# Altium project RGBlinker.PrjPcb
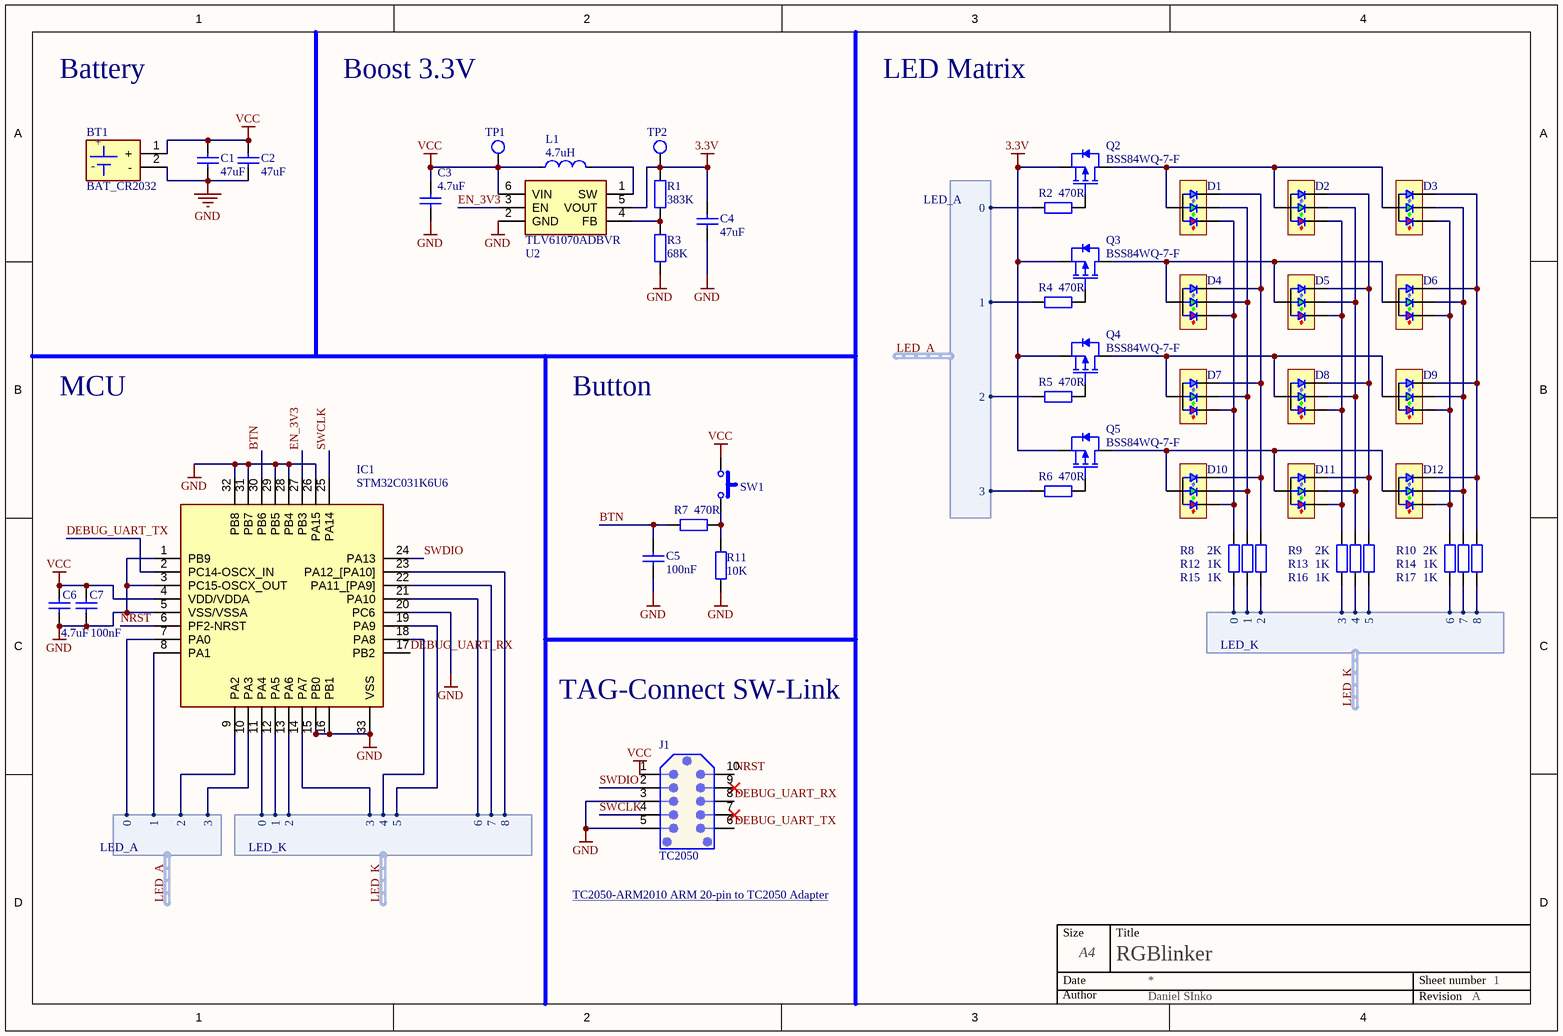
[diagram p0: Main.SchDoc]
1 sheet, 48 parts. Net scope: global (net labels, ports and power ports of the same name join across sheets).
Board file: RGBlink.PcbDoc

## Sheet Main.SchDoc: RGBlinker
size A4; Author: Daniel SInko; Revision: A; SheetNumber: 1; SheetTotal: 1

### Parts
BT1  BAT_CR2032  [BH25F1]
C1  47uF  [CAP0805]
C2  47uF  [CAP0805]
C3  4.7uF  [CAP0603]
C4  47uF  [CAP0805]
C5  100nF  [CAP0603]
C6  4.7uF  [CAP0603]
C7  100nF  [CAP0603]
D1  UHD111A-FKA-C3K23E1L3VG5ZB3Z3  [UHD111A-FKA-C3K23E1L3VG5ZB3Z3]  (value not drawn)
D2  UHD111A-FKA-C3K23E1L3VG5ZB3Z3  [UHD111A-FKA-C3K23E1L3VG5ZB3Z3]  (value not drawn)
D3  UHD111A-FKA-C3K23E1L3VG5ZB3Z3  [UHD111A-FKA-C3K23E1L3VG5ZB3Z3]  (value not drawn)
D4  UHD111A-FKA-C3K23E1L3VG5ZB3Z3  [UHD111A-FKA-C3K23E1L3VG5ZB3Z3]  (value not drawn)
D5  UHD111A-FKA-C3K23E1L3VG5ZB3Z3  [UHD111A-FKA-C3K23E1L3VG5ZB3Z3]  (value not drawn)
D6  UHD111A-FKA-C3K23E1L3VG5ZB3Z3  [UHD111A-FKA-C3K23E1L3VG5ZB3Z3]  (value not drawn)
D7  UHD111A-FKA-C3K23E1L3VG5ZB3Z3  [UHD111A-FKA-C3K23E1L3VG5ZB3Z3]  (value not drawn)
D8  UHD111A-FKA-C3K23E1L3VG5ZB3Z3  [UHD111A-FKA-C3K23E1L3VG5ZB3Z3]  (value not drawn)
D9  UHD111A-FKA-C3K23E1L3VG5ZB3Z3  [UHD111A-FKA-C3K23E1L3VG5ZB3Z3]  (value not drawn)
D10  UHD111A-FKA-C3K23E1L3VG5ZB3Z3  [UHD111A-FKA-C3K23E1L3VG5ZB3Z3]  (value not drawn)
D11  UHD111A-FKA-C3K23E1L3VG5ZB3Z3  [UHD111A-FKA-C3K23E1L3VG5ZB3Z3]  (value not drawn)
D12  UHD111A-FKA-C3K23E1L3VG5ZB3Z3  [UHD111A-FKA-C3K23E1L3VG5ZB3Z3]  (value not drawn)
IC1  STM32C031K6U6  [UFQFPN32-5x5]
J1  TC2050  [TC2050-NL]
L1  value 4.7uH  [IND0603]  (hidden comment: Inductor)
Q2  BSS84WQ-7-F  [SOT-323-3]
Q3  BSS84WQ-7-F  [SOT-323-3]
Q4  BSS84WQ-7-F  [SOT-323-3]
Q5  BSS84WQ-7-F  [SOT-323-3]
R1  383K  [RES0603]
R2  470R  [RES0603]
R3  68K  [RES0603]
R4  470R  [RES0603]
R5  470R  [RES0603]
R6  470R  [RES0603]
R7  470R  [RES0603]
R8  2K  [RES0603]
R9  2K  [RES0603]
R10  2K  [RES0603]
R11  10K  [RES0603]
R12  1K  [RES0603]
R13  1K  [RES0603]
R14  1K  [RES0603]
R15  1K  [RES0603]
R16  1K  [RES0603]
R17  1K  [RES0603]
SW1  TS18-5-25-SL-260-SMT-TR  [BUTTON_LP_5x5]  (value not drawn)
TP1  Test Point  [TP_PAD]  (value not drawn)
TP2  Test Point  [TP_PAD]  (value not drawn)
U2  TLV61070ADBVR  [SOT23-6]

### Harnesses
LED_K: 6, 7, 8, 0, 1, 2, 3, 4, 5
LED_A: 0, 1, 2, 3

### Nets
3.3V: C4.2 Q2.2(S) Q3.2(S) Q4.2(S) Q5.2(S) R1.2 TP2.1 U2.5(VOUT)
GND: BT1.2(-) C1.1 C2.1 C3.1 C4.1 C5.2 C6.1 C7.1 IC1.1(PB9) IC1.3(PC15-OSCX_OUT) IC1.5(VSS/VSSA) IC1.15(PB0) IC1.16(PB1) IC1.20(PC6) IC1.26(PA15) IC1.28(PB4) IC1.29(PB5) IC1.31(PB7) IC1.32(PB8) IC1.33(VSS) J1.3 J1.5 R3.1 R11.1 U2.2(GND)
VCC: BT1.1(+) C1.2 C2.2 C3.2 C6.2 C7.2 IC1.4(VDD/VDDA) J1.1 L1.1 SW1.1 TP1.1 U2.6(VIN)
BTN: C5.1 IC1.30(PB6) R7.2
DEBUG_UART_RX: IC1.17(PB2) J1.8
DEBUG_UART_TX: IC1.2(PC14-OSCX_IN) J1.6
EN_3V3: IC1.27(PB3) U2.3(EN)
LED_A.0: IC1.7(PA0) R2.2 ; harness LED_A.0
LED_A.1: IC1.8(PA1) R4.2 ; harness LED_A.1
LED_A.2: IC1.9(PA2) R5.2 ; harness LED_A.2
LED_A.3: IC1.10(PA3) R6.2 ; harness LED_A.3
LED_K.0: IC1.11(PA4) R8.1 ; harness LED_K.0
LED_K.1: IC1.12(PA5) R12.1 ; harness LED_K.1
LED_K.2: IC1.13(PA6) R15.1 ; harness LED_K.2
LED_K.3: IC1.14(PA7) R9.1 ; harness LED_K.3
LED_K.4: IC1.18(PA8) R13.1 ; harness LED_K.4
LED_K.5: IC1.19(PA9) R16.1 ; harness LED_K.5
LED_K.6: IC1.21(PA10) R10.1 ; harness LED_K.6
LED_K.7: IC1.22(PA11_[PA9]) R14.1 ; harness LED_K.7
LED_K.8: IC1.23(PA12_[PA10]) R17.1 ; harness LED_K.8
NRST: IC1.6(PF2-NRST) J1.10
SWCLK: IC1.25(PA14) J1.4
SWDIO: IC1.24(PA13) J1.2
NetD1_1: D1.1 D4.1 D7.1 D10.1 R15.2
NetD1_2: D1.2 D4.2 D7.2 D10.2 R12.2
NetD1_3: D1.3 D4.3 D7.3 D10.3 R8.2
NetD1_4: D1.4 D2.4 D3.4 Q2.3(D)
NetD2_1: D2.1 D5.1 D8.1 D11.1 R16.2
NetD2_2: D2.2 D5.2 D8.2 D11.2 R13.2
NetD2_3: D2.3 D5.3 D8.3 D11.3 R9.2
NetD3_1: D3.1 D6.1 D9.1 D12.1 R17.2
NetD3_2: D3.2 D6.2 D9.2 D12.2 R14.2
NetD3_3: D3.3 D6.3 D9.3 D12.3 R10.2
NetD4_4: D4.4 D5.4 D6.4 Q3.3(D)
NetD7_4: D7.4 D8.4 D9.4 Q4.3(D)
NetD10_4: D10.4 D11.4 D12.4 Q5.3(D)
NetL1_2: L1.2 U2.1(SW)
NetQ2_1: Q2.1(G) R2.1
NetQ3_1: Q3.1(G) R4.1
NetQ4_1: Q4.1(G) R5.1
NetQ5_1: Q5.1(G) R6.1
NetR1_1: R1.1 R3.2 U2.4(FB)
NetR7_1: R7.1 R11.2 SW1.2

Not connected (* = marked no-connect by the designer): J1 7* 9*

### Notes on the sheet
- Battery
- Boost 3.3V
- LED Matrix
- MCU
- Button
- TAG-Connect SW-Link
- TC2050-ARM2010 ARM 20-pin to TC2050 Adapter <https://www.tag-connect.com/wp-content/uploads/bsk-pdf-manager/2021/02/TC2050-ARM2010-2021.pdf>
- Size
- Date
- A4
- Title
- Sheet number
- Author
- Revision

### Library data of the parts
BT1 = BAT_CR2032: CR2032 isolated battery holder / BH-25F-1; Manufacturer_Name: Adam Tech; Datasheet Link: https://app.adam-tech.com/products/download/data_sheet/196966/bh-25f-1-data-sheet.pdf; Height: 9.5mm; Manufacturer_Part_Number: BH-25F-1; Mouser Price/Stock: https://www.mouser.co.uk/ProductDetail/Adam-Tech/BH-25F-1?qs=HoCaDK9Nz5dcCnxRauSciw%3D%3D; Arrow Part Number: BH-25F-1; Arrow Price/Stock: https://www.arrow.com/en/products/bh-25f-1/adam-tech?region=europe; Supplier Part Number: 737-BH-25F-1
C1 C2 C4 = 47uF: Ceramic Capacitor, Multilayer, Ceramic, 6.3V, 20% +Tol, 20% -Tol, X5R, 15% TC, 47uF, Surface Mount, 0805; Manufacturer: Samsung; Manufacturer Part Number: CL21A476MQYNNNE; Multilayer: Yes; Voltage: *; Supplier: Mouser; Supplier Part Number: 187-CL21A476MQYNNNE; RoHS: Yes; Category: Ceramic Capacitors; Stock: 210015; Pricing: 1=0.18, 10=0.073, 50=0.073, 100=0.063, 1000=0.052, 10000=0.041 (USD); Mounting Technology: Surface Mount; Pins: 2; Dielectric Material: Ceramic; Package Shape: Rectangular; Case/Package: 0805; Terminal Finish: Nickel; Min Operating Temperature: -55°C; Max Operating Temperature: 85°C; JESD-609 Code: e3; Capacitor Type: Ceramic; Tolerance  (fill in as +-): 20%; Package Style: SMTMeter; Packaging: Tape and Reel; Tolerance (fill in as +-): 20%; Rated DC Voltage (URdc): 6.3V; Temperature Characteristics Code: X5R; Termination: Wraparound; Length: 2mm; Width: 1.25mm; Height: 1.25mm; Reach SVHC Compliant: Yes; RoHS Compliant: Yes; ComponentLink1URL: https://datasheet.ciiva.com:443/pdfs/VipMasterIC/IC/SEMS/SEMS-S-A0008384515/SEMS-S-A0008898940-1.pdf?src-supplier=IHS+Markit; ComponentLink1Description: https://datasheet.ciiva.com:443/pdfs/VipMasterIC/IC/SEMS/SEMS-S-A0008384515/SEMS-S-A0008898940-1.pdf?src-supplier=IHS+Markit; ComponentLink2URL: https://datasheet.ciiva.com/25791/cl21a476mqynnne-25791153.pdf?src-supplier=Digikey; ComponentLink2Description: https://datasheet.ciiva.com/25791/cl21a476mqynnne-25791153.pdf?src-supplier=Digikey; ComponentLink3URL: https://datasheet.ciiva.com/26838/getdatasheetpartid-359050-26838632.pdf?src-supplier=Verical; ComponentLink3Description: https://datasheet.ciiva.com/26838/getdatasheetpartid-359050-26838632.pdf?src-supplier=Verical; Value: 47uF
C3 C6 = 4.7uF: Capacitor; Voltage: *; Value: 4.7uF; Supplier Part Number: 187-CL10A475KP8NNWC
C5 C7 = 100nF: Ceramic Capacitor, Multilayer, Ceramic, 6.3V, 20% +Tol, 20% -Tol, X5R, 15% TC, 47uF, Surface Mount, 0805; Manufacturer: Samsung; Manufacturer Part Number: CL21A476MQYNNNE; Multilayer: Yes; Voltage: *; Value: 100nF; Supplier: Mouser; Supplier Part Number: 187-CL21A476MQYNNNE; RoHS: Yes; Category: Ceramic Capacitors; Stock: 210015; Pricing: 1=0.18, 10=0.073, 50=0.073, 100=0.063, 1000=0.052, 10000=0.041 (USD); Mounting Technology: Surface Mount; Pins: 2; Dielectric Material: Ceramic; Package Shape: Rectangular; Case/Package: 0805; Terminal Finish: Nickel; Min Operating Temperature: -55°C; Max Operating Temperature: 85°C; JESD-609 Code: e3; Capacitor Type: Ceramic; Tolerance  (fill in as +-): 20%; Package Style: SMTMeter; Packaging: Tape and Reel; Tolerance (fill in as +-): 20%; Rated DC Voltage (URdc): 6.3V; Temperature Characteristics Code: X5R; Termination: Wraparound; Length: 2mm; Width: 1.25mm; Height: 1.25mm; Reach SVHC Compliant: Yes; RoHS Compliant: Yes; ComponentLink1URL: https://datasheet.ciiva.com:443/pdfs/VipMasterIC/IC/SEMS/SEMS-S-A0008384515/SEMS-S-A0008898940-1.pdf?src-supplier=IHS+Markit; ComponentLink1Description: https://datasheet.ciiva.com:443/pdfs/VipMasterIC/IC/SEMS/SEMS-S-A0008384515/SEMS-S-A0008898940-1.pdf?src-supplier=IHS+Markit; ComponentLink2URL: https://datasheet.ciiva.com/25791/cl21a476mqynnne-25791153.pdf?src-supplier=Digikey; ComponentLink2Description: https://datasheet.ciiva.com/25791/cl21a476mqynnne-25791153.pdf?src-supplier=Digikey; ComponentLink3URL: https://datasheet.ciiva.com/26838/getdatasheetpartid-359050-26838632.pdf?src-supplier=Verical; ComponentLink3Description: https://datasheet.ciiva.com/26838/getdatasheetpartid-359050-26838632.pdf?src-supplier=Verical
IC1 = STM32C031K6U6: Integrated Circuit; Manufacturer_Name: STMicroelectronics; Datasheet Link: https://www.st.com/resource/en/datasheet/stm32c031c4.pdf; Height: 0.6mm; Manufacturer_Part_Number: STM32C031K6U6; Mouser Price/Stock: https://www.mouser.co.uk/ProductDetail/STMicroelectronics/STM32C031K6U6?qs=IPgv5n7u5QaHL3ukKksvIA%3D%3D; Arrow Part Number: STM32C031K6U6; Arrow Price/Stock: https://www.arrow.com/en/products/stm32c031k6u6/stmicroelectronics?region=nac; Supplier Part Number: 511-STM32C031K6U6
J1 = TC2050: TC2050 JTAG CONNECTOR DNP
L1 = 4.7uH: General Purpose Inductor, 4.7uH, 20%, 1 Element, Ferrite-Core, SMD, 1608M; Manufacturer: TDK; Manufacturer Part Number: MLZ1608E4R7MT; Manufacturer Series: MLZ; Case/Size Code: 1608-M; DC Resistance (DCR): 500mR; Inductor Application: POWER INDUCTOR; Channels: 1; Max Current Rating: 350mA; Self Resonant Frequency: 80MHz; Shape/Size Description: RECTANGULAR PACKAGE; Shielding: Shielded; Test Frequency: 2MHz; Package Height: 0.8mm; Package Length: 1.6mm; Supplier: Mouser; Supplier Part Number: 810-MLZ1608E4R7MT; RoHS: Yes; Category: Fixed Inductors; Stock: 10382; Pricing: 1=0.1, 10=0.063, 50=0.063, 100=0.053, 1000=0.047, 10000=0.038 (USD); Pins: 2; Terminal Finish: Tin; Core Material: Ferrite; Min Operating Temperature: -55°C; Max Operating Temperature: 125°C; Tolerance: 20%; JESD-609 Code: e3; Inductance-Nom (L): 4.7uH; Inductor Type: GENERAL PURPOSE INDUCTOR; Surface Mount: Yes; Terminal Placement: Dual Ended; Termination: Wraparound; Construction: Magnetic Shielded; Package Style: SMTMeter; Packaging: Tape and Reel; Series: MLZ1608; Package Width: 0.8mm; Reach SVHC Compliant: Yes; RoHS Compliant: Yes; ComponentLink1URL: https://datasheet.ciiva.com:443/pdfs/VipMasterIC/IC/TDKC/TDKCS08829/TDKCS08829-1.pdf?src-supplier=IHS+Markit; ComponentLink1Description: https://datasheet.ciiva.com:443/pdfs/VipMasterIC/IC/TDKC/TDKCS08829/TDKCS08829-1.pdf?src-supplier=IHS+Markit; ComponentLink2URL: https://datasheet.ciiva.com/11802/0900766b8082f86f-11802261.pdf?src-supplier=Rs; ComponentLink2Description: https://datasheet.ciiva.com/11802/0900766b8082f86f-11802261.pdf?src-supplier=Rs
Q2-Q5 = BSS84WQ-7-F: MOSFET (P-Channel); Manufacturer_Name: Diodes Incorporated; Datasheet Link: https://www.diodes.com//assets/Datasheets/BSS84WQ.pdf; Height: 1.1mm; Manufacturer_Part_Number: BSS84WQ-7-F; Mouser Price/Stock: https://www.mouser.co.uk/ProductDetail/Diodes-Incorporated/BSS84WQ-7-F?qs=wtVJq%252Be05r%252B5TZHG3xVH8w%3D%3D; Arrow Part Number: BSS84WQ-7-F; Arrow Price/Stock: https://www.arrow.com/en/products/bss84wq-7-f/diodes-incorporated?region=nac; Supplier Part Number: 621-BSS84WQ-7-F
R1 = 383K: Fixed Resistor, Metal Glaze/thick Film, 0.1W, 383000ohm, 75V, 1% +/-Tol, 100ppm/Cel, Surface Mount, 0603; Manufacturer: Vishay; Manufacturer Part Number: CRCW0603383KFKEA; Temperature Coefficient (ppm/Cel): 100; Rated Temperature: 70°C; Package Height: 0.45mm; Package Length: 1.55mm; Package Width: 0.85mm; Reference Standard: AEC-Q200; Value: 383K; Supplier Part Number: 71-CRCW0603-383K-E3; RoHS: Yes; Category: Chip SMD Resistors; Stock: 18992; Pricing: 1=0.1, 10=0.017, 50=0.017, 100=0.014, 1000=0.008, 10000=0.004 (USD); Mounting Technology: Surface Mount; Pins: 2; Case/Package: 0603; Terminal Finish: Nickel; Package Shape: Rectangular; Min Operating Temperature: -55°C; Max Operating Temperature: 155°C; JESD-609 Code: e3; Resistor Type: FIXED RESISTOR; Construction: Chip; Packaging: Tape and Reel; Technology: METAL GLAZE/THICK FILM; Working Voltage: 75V; Termination: Wraparound; Reach SVHC Compliant: Yes; RoHS Compliant: Yes; ComponentLink1URL: https://datasheet.ciiva.com:443/pdfs/VipMasterIC/IC/VISH/VISH-S-A0007266705/VISH-S-A0007266705-1.pdf?src-supplier=IHS+Markit; ComponentLink1Description: https://datasheet.ciiva.com:443/pdfs/VipMasterIC/IC/VISH/VISH-S-A0007266705/VISH-S-A0007266705-1.pdf?src-supplier=IHS+Markit; ComponentLink2URL: https://datasheet.ciiva.com/16204/dcrcwe3-16204191.pdf?src-supplier=Future+Electronics; ComponentLink2Description: https://datasheet.ciiva.com/16204/dcrcwe3-16204191.pdf?src-supplier=Future+Electronics; ComponentLink3URL: https://datasheet.ciiva.com/5543/dcrcwe3-109170-5543275.pdf?src-supplier=Mouser; ComponentLink3Description: https://datasheet.ciiva.com/5543/dcrcwe3-109170-5543275.pdf?src-supplier=Mouser; ComponentLink4URL: https://datasheet.ciiva.com/7674/1697337-7674088.pdf?src-supplier=Element14; ComponentLink4Description: https://datasheet.ciiva.com/7674/1697337-7674088.pdf?src-supplier=Element14; ComponentLink5URL: https://datasheet.ciiva.com/7674/1697337-7674089.pdf?src-supplier=Element14; ComponentLink5Description: https://datasheet.ciiva.com/7674/1697337-7674089.pdf?src-supplier=Element14; ComponentLink6URL: https://datasheet.ciiva.com/7792/125364-7792239.pdf?src-supplier=Element14; ComponentLink6Description: https://datasheet.ciiva.com/7792/125364-7792239.pdf?src-supplier=Element14; ComponentLink7URL: https://datasheet.ciiva.com/2466/dcrcwe3-2466635.pdf?src-supplier=Digikey; ComponentLink7Description: https://datasheet.ciiva.com/2466/dcrcwe3-2466635.pdf?src-supplier=Digikey; ComponentLink8URL: https://datasheet.ciiva.com/2466/dcrcwe3-2466636.pdf?src-supplier=Digikey; ComponentLink8Description: https://datasheet.ciiva.com/2466/dcrcwe3-2466636.pdf?src-supplier=Digikey; ComponentLink9URL: https://datasheet.ciiva.com/2466/dcrcwe3-2466637.pdf?src-supplier=Digikey; ComponentLink9Description: https://datasheet.ciiva.com/2466/dcrcwe3-2466637.pdf?src-supplier=Digikey
R2 R4-R7 = 470R: Fixed Resistor, Metal Glaze/thick Film, 0.1W, 470ohm, 75V, 1% +/-Tol, 100ppm/Cel, Surface Mount, 0603; Manufacturer: Yageo; Manufacturer Part Number: RC0603FR-07470RL; Additional Feature: LASER TRIMMABLE; Rated Temperature: 70°C; Temperature Coefficient (ppm/Cel): 100; Package Height: 0.45mm; Package Length: 1.6mm; Package Width: 0.8mm; Value: 470R; Supplier Part Number: 603-RC0603FR-07470RL; RoHS: Yes; Category: Chip SMD Resistors; Stock: 609861; Pricing: 1=0.1, 10=0.008, 50=0.008, 100=0.007, 1000=0.006, 10000=0.002 (USD); Mounting Technology: Surface Mount; Pins: 2; Package Shape: Rectangular; Case/Package: 0603; Terminal Finish: Nickel; Min Operating Temperature: -55°C; Max Operating Temperature: 155°C; JESD-609 Code: e3; Resistor Type: FIXED RESISTOR; Construction: Chip; Packaging: Tape and Reel; Technology: METAL GLAZE/THICK FILM; Termination: Wraparound; Working Voltage: 75V; Reach SVHC Compliant: Yes; RoHS Compliant: Yes; ComponentLink1URL: https://datasheet.ciiva.com:443/pdfs/VipMasterIC/IC/YAGO/YAGO-S-A0008145938/YAGO-S-A0008145938-1.pdf?src-supplier=IHS+Markit; ComponentLink1Description: https://datasheet.ciiva.com:443/pdfs/VipMasterIC/IC/YAGO/YAGO-S-A0008145938/YAGO-S-A0008145938-1.pdf?src-supplier=IHS+Markit; ComponentLink2URL: https://datasheet.ciiva.com/11808/0900766b80f96399-11808177.pdf?src-supplier=Rs; ComponentLink2Description: https://datasheet.ciiva.com/11808/0900766b80f96399-11808177.pdf?src-supplier=Rs; ComponentLink3URL: https://datasheet.ciiva.com/7660/1868787-7660793.pdf?src-supplier=Element14; ComponentLink3Description: https://datasheet.ciiva.com/7660/1868787-7660793.pdf?src-supplier=Element14; ComponentLink4URL: https://datasheet.ciiva.com/46440/1868787-46440907.pdf?src-supplier=Element14; ComponentLink4Description: https://datasheet.ciiva.com/46440/1868787-46440907.pdf?src-supplier=Element14; ComponentLink5URL: https://datasheet.ciiva.com/2454/pyu-r-int-thick-7-2454013.pdf?src-supplier=Digikey; ComponentLink5Description: https://datasheet.ciiva.com/2454/pyu-r-int-thick-7-2454013.pdf?src-supplier=Digikey; ComponentLink6URL: https://datasheet.ciiva.com/2454/pyu-r-int-thick-7-2454014.pdf?src-supplier=Digikey; ComponentLink6Description: https://datasheet.ciiva.com/2454/pyu-r-int-thick-7-2454014.pdf?src-supplier=Digikey; ComponentLink7URL: https://datasheet.ciiva.com/2454/pyu-r-int-thick-7-2454012.pdf?src-supplier=Digikey; ComponentLink7Description: https://datasheet.ciiva.com/2454/pyu-r-int-thick-7-2454012.pdf?src-supplier=Digikey; ComponentLink8URL: https://datasheet.ciiva.com/7746/1738695-7746360.pdf?src-supplier=Element14; ComponentLink8Description: https://datasheet.ciiva.com/7746/1738695-7746360.pdf?src-supplier=Element14; ComponentLink9URL: https://datasheet.ciiva.com/7746/1738695-7746359.pdf?src-supplier=Element14; ComponentLink9Description: https://datasheet.ciiva.com/7746/1738695-7746359.pdf?src-supplier=Element14
R3 = 68K: Fixed Resistor, Metal Glaze/thick Film, 0.1W, 68000ohm, 50V, 1% +/-Tol, 100ppm/Cel, Surface Mount, 0603; Manufacturer: TE Connectivity; Manufacturer Part Number: CRG0603F68K; Manufacturer Series: CRG; Additional Feature: LASER TRIMMABLE; Rated Temperature: 70°C; Temperature Coefficient (ppm/Cel): 100; Value: 68K; Supplier Part Number: 279-CRG0603F68K; RoHS: Yes; Category: Chip SMD Resistors; Stock: 24887; Pricing: 1=0.1, 10=0.019, 50=0.019, 100=0.011, 1000=0.006, 10000=0.004 (USD); Mounting Technology: Surface Mount; Pins: 2; Package Shape: Rectangular; Case/Package: 0603; Terminal Finish: Tin; Min Operating Temperature: -55°C; Max Operating Temperature: 125°C; JESD-609 Code: e3; Resistor Type: FIXED RESISTOR; Packaging: Tape and Reel; Technology: METAL GLAZE/THICK FILM; Termination: Wraparound; Working Voltage: 50V; RoHS Compliant: Yes; ComponentLink1URL: https://datasheet.ciiva.com:443/pdfs/VipMasterIC/IC/TYEC/TYECS00469/TYECS00469-1.pdf?src-supplier=IHS+Markit; ComponentLink1Description: https://datasheet.ciiva.com:443/pdfs/VipMasterIC/IC/TYEC/TYECS00469/TYECS00469-1.pdf?src-supplier=IHS+Markit; ComponentLink2URL: https://datasheet.ciiva.com/2529/eng-cd-1622987-ba-2529849.pdf?src-supplier=Digikey; ComponentLink2Description: https://datasheet.ciiva.com/2529/eng-cd-1622987-ba-2529849.pdf?src-supplier=Digikey; ComponentLink3URL: https://datasheet.ciiva.com/11811/0900766b800a696e-11811113.pdf?src-supplier=Rs; ComponentLink3Description: https://datasheet.ciiva.com/11811/0900766b800a696e-11811113.pdf?src-supplier=Rs; ComponentLink4URL: https://datasheet.ciiva.com/30183/eng-ds-1773204-e-30183934.pdf?src-supplier=Onlinecomponents.com; ComponentLink4Description: https://datasheet.ciiva.com/30183/eng-ds-1773204-e-30183934.pdf?src-supplier=Onlinecomponents.com; ComponentLink5URL: https://datasheet.ciiva.com/5562/eng-ds-1773204-g-5562568.pdf?src-supplier=Mouser; ComponentLink5Description: https://datasheet.ciiva.com/5562/eng-ds-1773204-g-5562568.pdf?src-supplier=Mouser; ComponentLink6URL: https://datasheet.ciiva.com/24412/eng-ds-1773204-e-24412331.pdf?src-supplier=Onlinecomponents.com; ComponentLink6Description: https://datasheet.ciiva.com/24412/eng-ds-1773204-e-24412331.pdf?src-supplier=Onlinecomponents.com
R8-R10 = 2K: Fixed Resistor, Metal Glaze/thick Film, 0.1W, 2000ohm, 75V, 1% +/-Tol, 100ppm/Cel, Surface Mount, 0603; Manufacturer: Stackpole Electronics; Manufacturer Part Number: RMCF0603FG2K00; Rated Temperature: 70°C; Temperature Coefficient (ppm/Cel): 100; Package Height: 0.45mm; Package Length: 1.55mm; Package Width: 0.8mm; Reference Standard: AEC-Q200; Supplier Part Number: 708-RMCF0603FG2K00; RoHS: Yes; Category: Chip SMD Resistors; Stock: 24767; Pricing: 1=0.1, 10=0.009, 50=0.009, 100=0.008, 1000=0.004, 10000=0.002 (USD); Mounting Technology: Surface Mount; Pins: 2; Package Shape: Rectangular; Case/Package: 0603; Terminal Finish: Nickel; Min Operating Temperature: -55°C; Max Operating Temperature: 155°C; JESD-609 Code: e3; Resistor Type: FIXED RESISTOR; Construction: Rectangular; Packaging: Tape and Reel; Technology: METAL GLAZE/THICK FILM; Termination: Wraparound; Working Voltage: 75V; Reach SVHC Compliant: Yes; RoHS Compliant: Yes; ComponentLink1URL: https://datasheet.ciiva.com:443/pdfs/VipMasterIC/IC/SEIE/SEIE-S-A0009541969/SEIE-S-A0009541969-1.pdf?src-supplier=IHS+Markit; ComponentLink1Description: https://datasheet.ciiva.com:443/pdfs/VipMasterIC/IC/SEIE/SEIE-S-A0009541969/SEIE-S-A0009541969-1.pdf?src-supplier=IHS+Markit; ComponentLink2URL: https://www.seielect.com/catalog/sei-rmcf_rmcp.pdf?src-supplier=Digikey; ComponentLink2Description: https://www.seielect.com/catalog/sei-rmcf_rmcp.pdf?src-supplier=Digikey; ComponentLink3URL: https://www.seielect.com/catalog/SEI-RMCF_RMCP.pdf?src-supplier=Avnet; ComponentLink3Description: https://www.seielect.com/catalog/SEI-RMCF_RMCP.pdf?src-supplier=Avnet; Value: 2K
R11 = 10K: Fixed Resistor, Metal Glaze/thick Film, 0.1W, 10000ohm, 75V, 1% +/-Tol, 100ppm/Cel, Surface Mount, 0603; Manufacturer: Bourns; Manufacturer Part Number: CR0603-FX-1002ELF; Rated Temperature: 70°C; Temperature Coefficient: 100ppm/°C; Working Voltage: 50V; Package Height: 0.45mm; Package Length: 1.6mm; Package Width: 0.8mm; Supplier Part Number: 652-CR0603FX-1002ELF; RoHS: Yes; Category: Chip SMD Resistors; Stock: 335503; Pricing: 1=0.1, 10=0.009, 50=0.009, 100=0.005, 1000=0.004, 10000=0.002 (USD); Mounting Technology: Surface Mount; Pins: 2; Package Shape: Rectangular; Case/Package: 0603; Terminal Finish: Nickel; Min Operating Temperature: -55°C; Max Operating Temperature: 155°C; Termination: Wraparound; JESD-609 Code: e3; Resistor Type: FIXED RESISTOR; Construction: Chip; Packaging: Tape and Reel; Technology: RUTHENIUM OXIDE; Reach SVHC Compliant: Yes; RoHS Compliant: Yes; ComponentLink1URL: https://datasheet.ciiva.com:443/pdfs/VipMasterIC/IC/BOUR/BOUR-S-A0009069624/BOUR-S-A0009069624-1.pdf?src-supplier=IHS+Markit; ComponentLink1Description: https://datasheet.ciiva.com:443/pdfs/VipMasterIC/IC/BOUR/BOUR-S-A0009069624/BOUR-S-A0009069624-1.pdf?src-supplier=IHS+Markit; ComponentLink2URL: https://datasheet.ciiva.com/11808/0900766b80fcdb72-11808032.pdf?src-supplier=Rs; ComponentLink2Description: https://datasheet.ciiva.com/11808/0900766b80fcdb72-11808032.pdf?src-supplier=Rs; ComponentLink3URL: https://datasheet.ciiva.com/27049/774903-27049975.pdf?src-supplier=Jameco; ComponentLink3Description: https://datasheet.ciiva.com/27049/774903-27049975.pdf?src-supplier=Jameco; ComponentLink4URL: https://datasheet.ciiva.com/22644/1849498-22644171.pdf?src-supplier=Element14; ComponentLink4Description: https://datasheet.ciiva.com/22644/1849498-22644171.pdf?src-supplier=Element14; ComponentLink5URL: https://datasheet.ciiva.com/22693/1902866-22693206.pdf?src-supplier=Element14; ComponentLink5Description: https://datasheet.ciiva.com/22693/1902866-22693206.pdf?src-supplier=Element14; ComponentLink6URL: https://datasheet.ciiva.com/5548/chpreztr-5548911.pdf?src-supplier=Mouser; ComponentLink6Description: https://datasheet.ciiva.com/5548/chpreztr-5548911.pdf?src-supplier=Mouser; ComponentLink7URL: https://datasheet.ciiva.com/16757/70154685-16757483.pdf?src-supplier=Allied+Electronics; ComponentLink7Description: https://datasheet.ciiva.com/16757/70154685-16757483.pdf?src-supplier=Allied+Electronics; ComponentLink8URL: https://datasheet.ciiva.com/3255/chpreztr-3255918.pdf?src-supplier=Avnet; ComponentLink8Description: https://datasheet.ciiva.com/3255/chpreztr-3255918.pdf?src-supplier=Avnet; ComponentLink9URL: https://datasheet.ciiva.com/7001/1902866-7001623.pdf?src-supplier=Newark; ComponentLink9Description: https://datasheet.ciiva.com/7001/1902866-7001623.pdf?src-supplier=Newark; Value: 10K
R12-R17 = 1K: Fixed Resistor, Metal Glaze/thick Film, 0.1W, 1000ohm, 75V, 1% +/-Tol, 100ppm/Cel, Surface Mount, 0603; Manufacturer: Bourns; Manufacturer Part Number: CR0603-FX-1001ELF; Rated Temperature: 70°C; Temperature Coefficient: 100ppm/°C; Working Voltage: 50V; Package Height: 0.45mm; Package Length: 1.6mm; Package Width: 0.8mm; Supplier Part Number: 652-CR0603FX-1001ELF; RoHS: Yes; Category: Chip SMD Resistors; Stock: 320220; Pricing: 1=0.1, 10=0.009, 50=0.009, 100=0.005, 1000=0.004, 10000=0.002 (USD); Mounting Technology: Surface Mount; Pins: 2; Package Shape: Rectangular; Case/Package: 0603; Terminal Finish: Nickel; Min Operating Temperature: -55°C; Max Operating Temperature: 155°C; JESD-609 Code: e3; Termination: Wraparound; Resistor Type: FIXED RESISTOR; Construction: Chip; Packaging: Tape and Reel; Technology: RUTHENIUM OXIDE; Reach SVHC Compliant: Yes; RoHS Compliant: Yes; ComponentLink1URL: https://datasheet.ciiva.com:443/pdfs/VipMasterIC/IC/BOUR/BOUR-S-A0009069624/BOUR-S-A0009069624-1.pdf?src-supplier=IHS+Markit; ComponentLink1Description: https://datasheet.ciiva.com:443/pdfs/VipMasterIC/IC/BOUR/BOUR-S-A0009069624/BOUR-S-A0009069624-1.pdf?src-supplier=IHS+Markit; ComponentLink2URL: https://datasheet.ciiva.com/11808/0900766b80fcdb72-11808035.pdf?src-supplier=Rs; ComponentLink2Description: https://datasheet.ciiva.com/11808/0900766b80fcdb72-11808035.pdf?src-supplier=Rs; ComponentLink3URL: https://datasheet.ciiva.com/19466/774882-19466523.pdf?src-supplier=Jameco; ComponentLink3Description: https://datasheet.ciiva.com/19466/774882-19466523.pdf?src-supplier=Jameco; ComponentLink4URL: https://datasheet.ciiva.com/7001/1902866-7001622.pdf?src-supplier=Newark; ComponentLink4Description: https://datasheet.ciiva.com/7001/1902866-7001622.pdf?src-supplier=Newark; ComponentLink5URL: https://datasheet.ciiva.com/7986/691949-7986156.pdf?src-supplier=Element14; ComponentLink5Description: https://datasheet.ciiva.com/7986/691949-7986156.pdf?src-supplier=Element14; ComponentLink6URL: https://datasheet.ciiva.com/22693/1902866-22693205.pdf?src-supplier=Element14; ComponentLink6Description: https://datasheet.ciiva.com/22693/1902866-22693205.pdf?src-supplier=Element14; ComponentLink7URL: https://datasheet.ciiva.com/5546/chpreztr-5546283.pdf?src-supplier=Mouser; ComponentLink7Description: https://datasheet.ciiva.com/5546/chpreztr-5546283.pdf?src-supplier=Mouser; ComponentLink8URL: https://datasheet.ciiva.com/16757/70154685-16757482.pdf?src-supplier=Allied+Electronics; ComponentLink8Description: https://datasheet.ciiva.com/16757/70154685-16757482.pdf?src-supplier=Allied+Electronics; ComponentLink9URL: https://datasheet.ciiva.com/3255/chpreztr-3255917.pdf?src-supplier=Avnet; ComponentLink9Description: https://datasheet.ciiva.com/3255/chpreztr-3255917.pdf?src-supplier=Avnet; ComponentLink10URL: https://datasheet.ciiva.com/6547/chpreztr-6547350.pdf?src-supplier=Digikey; ComponentLink10Description: https://datasheet.ciiva.com/6547/chpreztr-6547350.pdf?src-supplier=Digikey; ComponentLink11URL: https://datasheet.ciiva.com/6547/chpreztr-6547351.pdf?src-supplier=Digikey; ComponentLink11Description: https://datasheet.ciiva.com/6547/chpreztr-6547351.pdf?src-supplier=Digikey; ComponentLink12URL: https://datasheet.ciiva.com/6547/chpreztr-6547349.pdf?src-supplier=Digikey; ComponentLink12Description: https://datasheet.ciiva.com/6547/chpreztr-6547349.pdf?src-supplier=Digikey; ComponentLink13URL: https://datasheet.ciiva.com/30115/159chpreztr-30115222.pdf?src-supplier=Onlinecomponents.com; ComponentLink13Description: https://datasheet.ciiva.com/30115/159chpreztr-30115222.pdf?src-supplier=Onlinecomponents.com; Value: 1K
SW1 = TS18-5-25-SL-260-SMT-TR: Switch; Manufacturer_Name: Same Sky; Datasheet Link: https://www.sameskydevices.com/product/resource/supplyframepdf/ts18.pdf; Height: 2.7mm; Manufacturer_Part_Number: TS18-5-25-SL-260-SMT-TR; Mouser Price/Stock: https://www.mouser.co.uk/ProductDetail/Same-Sky/TS18-5-25-SL-260-SMT-TR?qs=tlsG%2FOw5FFh0yS4gYnfcwg%3D%3D; Supplier Part Number: 179-TS18525SL260SMTT
U2 = TLV61070ADBVR: Integrated Circuit; Manufacturer_Name: Texas Instruments; Datasheet Link: https://www.ti.com/lit/ds/symlink/tlv61070a.pdf?HQS=dis-mous-null-mousermode-dsf-pf-null-wwe&ts=1668211309833&ref_url=https%253A%252F%252Fwww.mouser.com%252F; Height: 1.45mm; Manufacturer_Part_Number: TLV61070ADBVR; Mouser Price/Stock: https://www.mouser.co.uk/ProductDetail/Texas-Instruments/TLV61070ADBVR?qs=T%252BzbugeAwjhLlT1empixsw%3D%3D; Arrow Part Number: TLV61070ADBVR; Arrow Price/Stock: https://www.arrow.com/en/products/tlv61070adbvr/texas-instruments?utm_currency=USD&region=nac; Supplier Part Number: 595-TLV61070ADBVR
D1-D12 = UHD111A-FKA-C3K23E1L3VG5ZB3Z3: Supplier Part Number: 941-UHD1AA3K3E3V53Z3